# Altium schematic sheet LAUNCHPAD.SchDoc
size 558 x 431 mm; Engineer: Nicholas Oborny; Revision: A.1; Name: Nicholas Oborny; Start Date: 7/23/2012
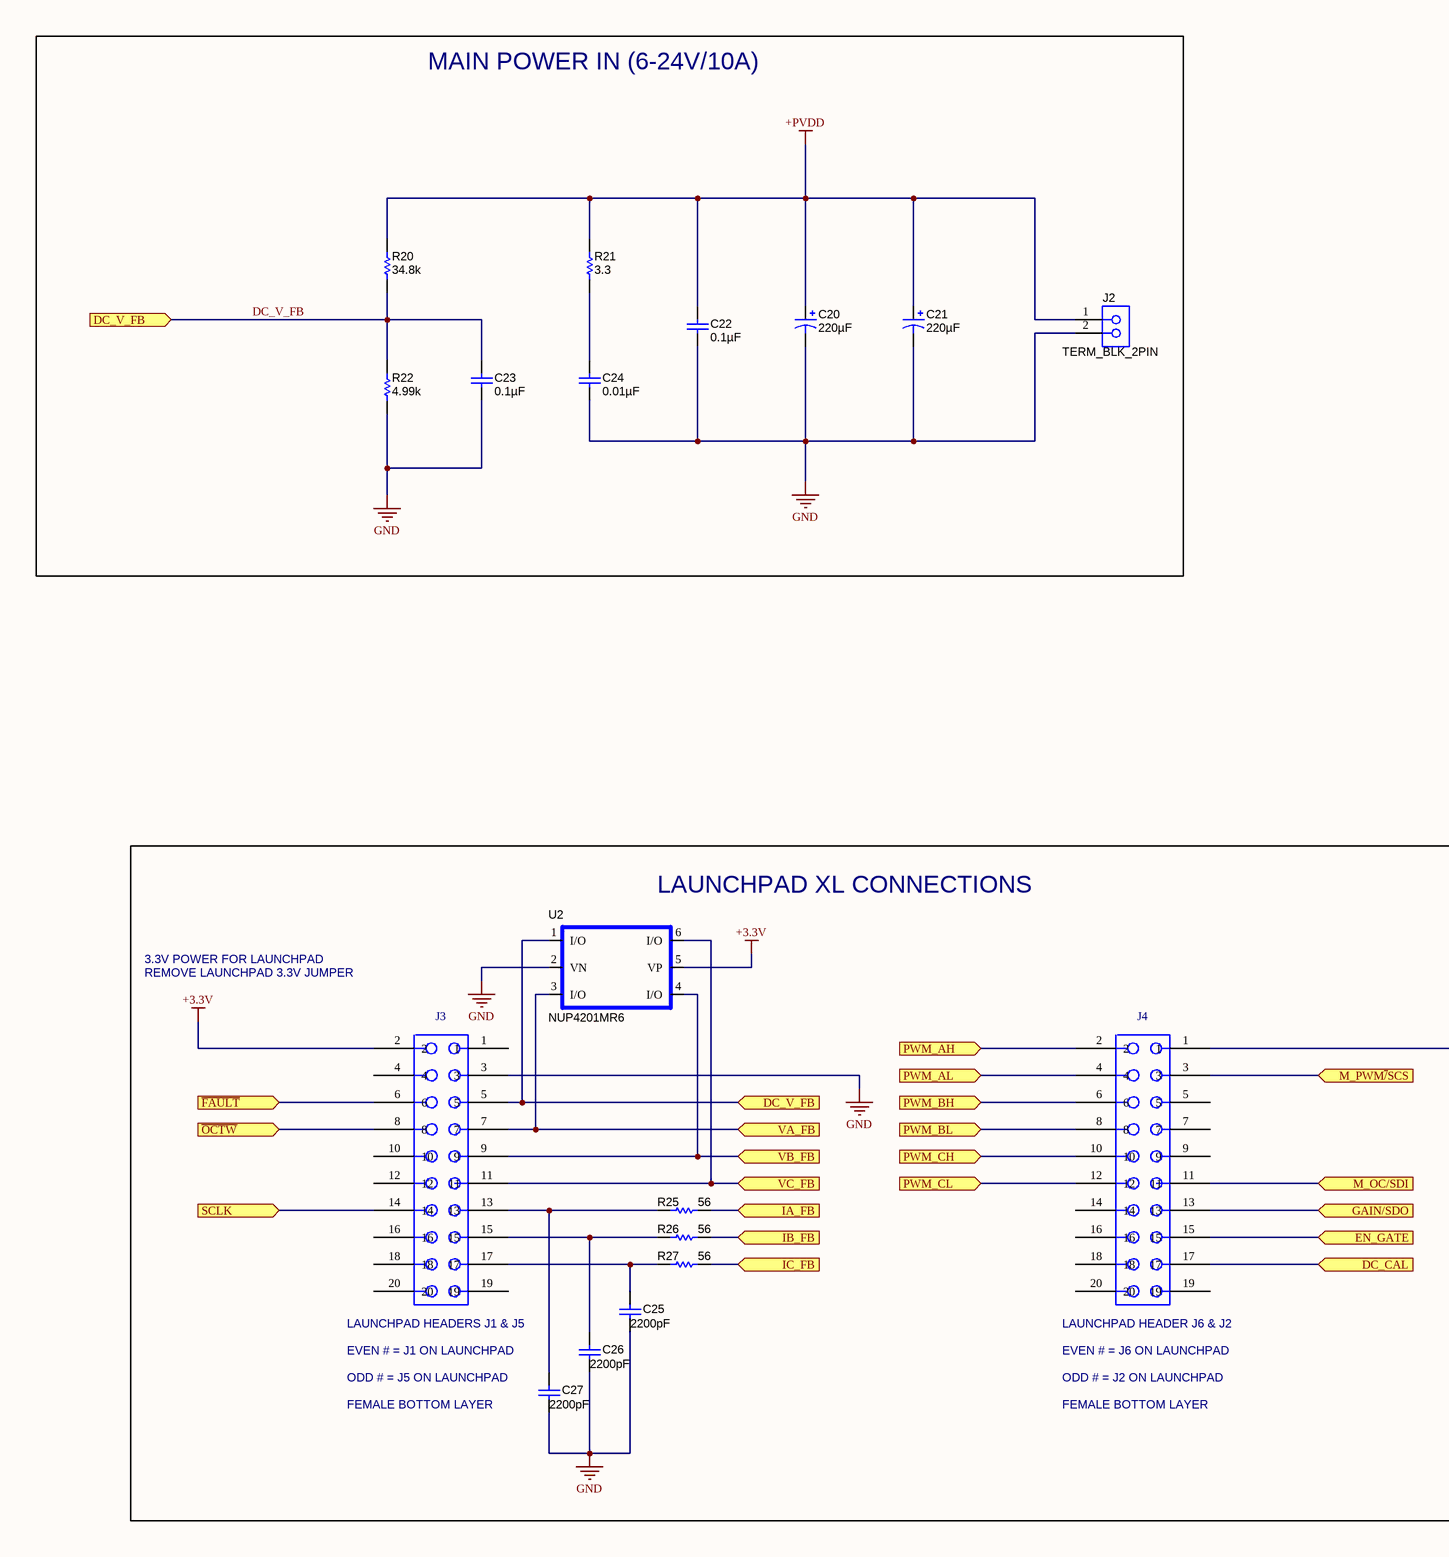
[diagram p0: LAUNCHPAD.SchDoc, left]
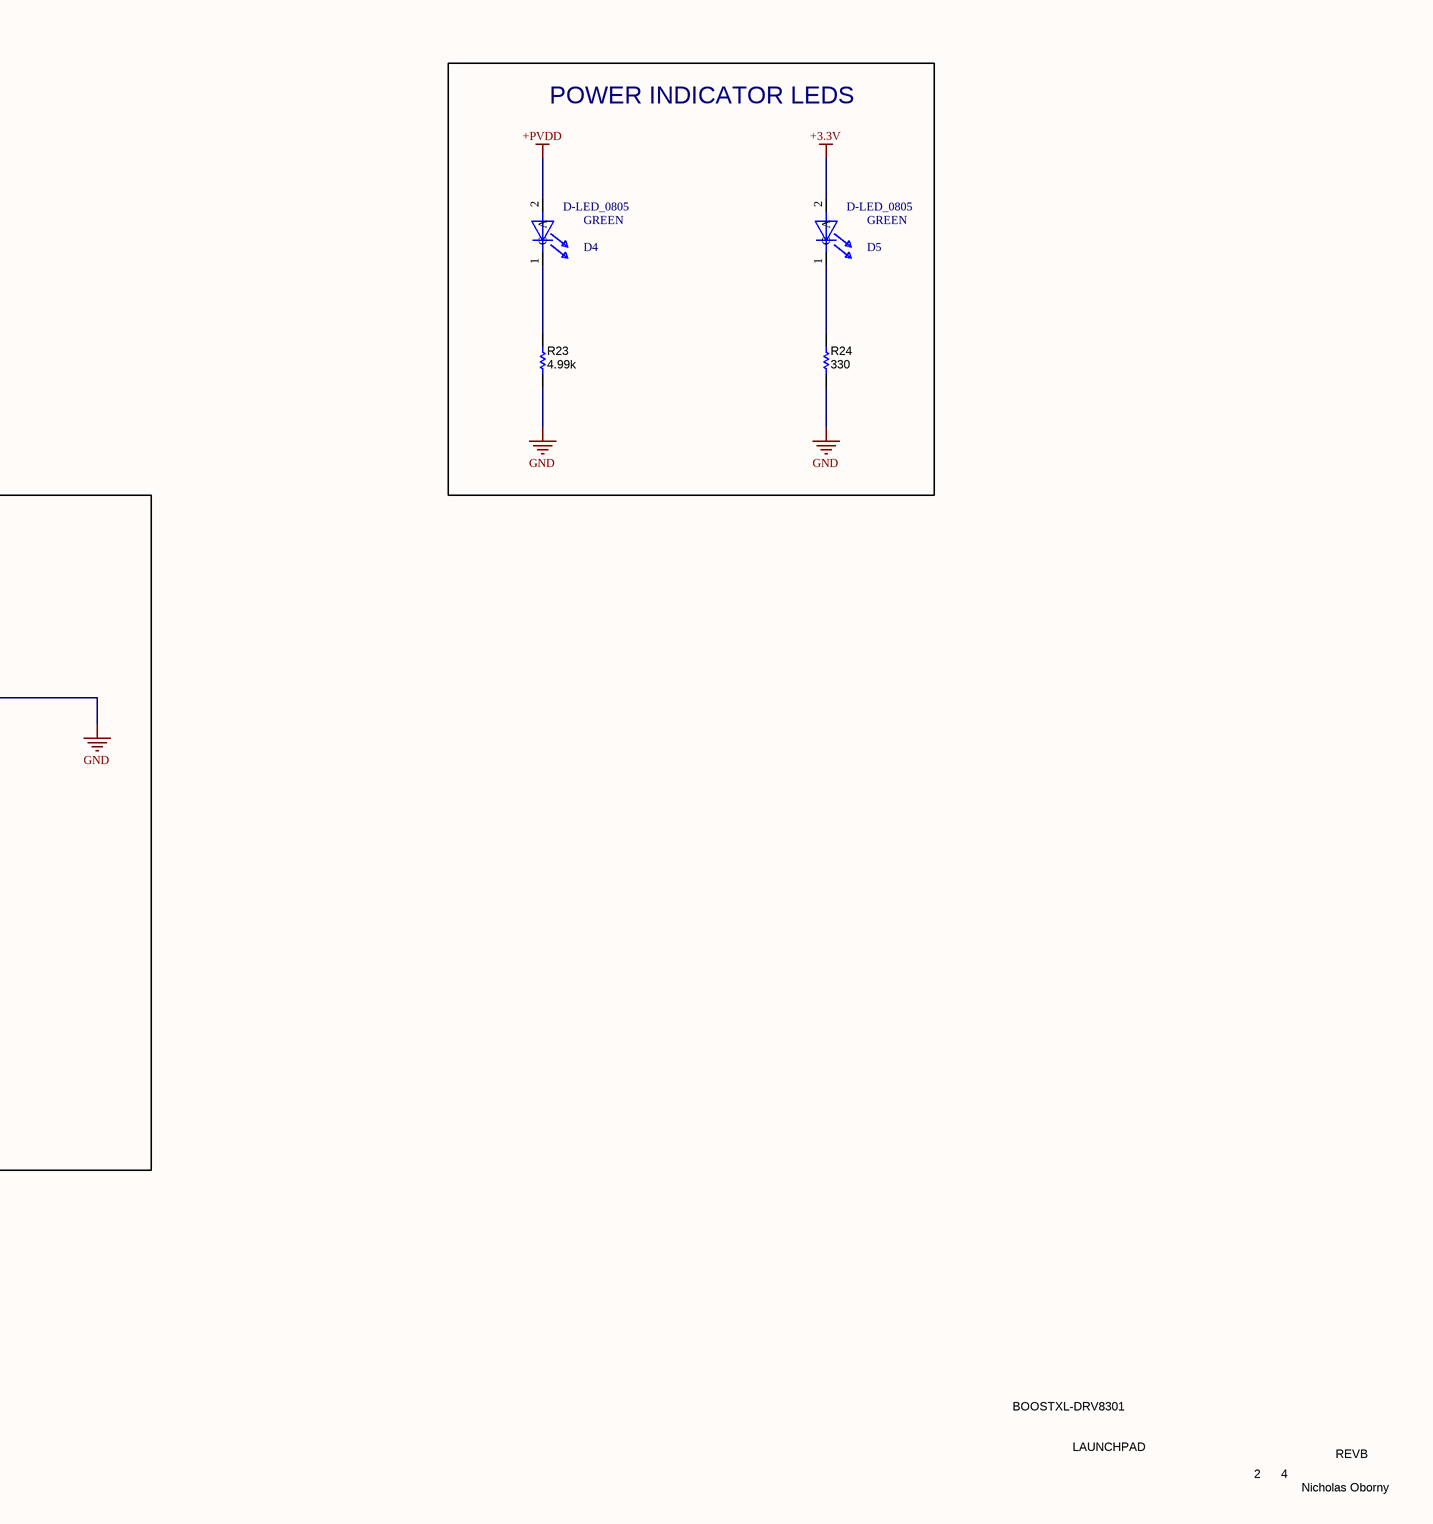
[diagram p1: LAUNCHPAD.SchDoc, right]

## Parts
C20  ValueDisplayed: 220µF  [SM_RADIAL_G]  (hidden comment: EEE-FC1H221P)
C21  ValueDisplayed: 220µF  [SM_RADIAL_G]  (hidden comment: EEE-FC1H221P)
C22  ValueDisplayed: 0.1µF  [0603L]  (hidden comment: GRM188R72A104KA35D)
C23  ValueDisplayed: 0.1µF  [0603L]  (hidden comment: C0603C104J4RACTU)
C24  ValueDisplayed: 0.01µF  [0603L]  (hidden comment: C1608X7R2A103K)
C25  ValueDisplayed: 2200pF  [0603L]  (hidden comment: GRM188R71C222KA01D)
C26  ValueDisplayed: 2200pF  [0603L]  (hidden comment: GRM188R71C222KA01D)
C27  ValueDisplayed: 2200pF  [0603L]  (hidden comment: GRM188R71C222KA01D)
D4  D-LED_0805  value GREEN  [LED_0805]
D5  D-LED_0805  value GREEN  [LED_0805]
J2  TERM_BLK_2PIN  [CONN_ED120-2DS]
J3  HEADER_NPTC202KFM  (value not drawn)
J4  HEADER_NPTC202KFM  (value not drawn)
R20  value 34.8k  [0603L]  (hidden comment: CRCW060334K8FKEA)
R21  value 3.3  [1206L]  (hidden comment: CRCW12063R30JNEA)
R22  value 4.99k  [0603L]  (hidden comment: CRCW06034K99FKEA)
R23  value 4.99k  [0603L]  (hidden comment: CRCW06034K99FKEA)
R24  value 330  [0603L]  (hidden comment: CRCW0603330RJNEA)
R25  value 56  [0603L]  (hidden comment: CRCW060356R0JNEA)
R26  value 56  [0603L]  (hidden comment: CRCW060356R0JNEA)
R27  value 56  [0603L]  (hidden comment: CRCW060356R0JNEA)
U2  NUP4201MR6  [SOT23-6]

## Blocks framed on the sheet
MAIN POWER IN (6-24V/10A): C20-C24 J2 R20-R22
POWER INDICATOR LEDS: D4 D5 R23 R24
LAUNCHPAD XL CONNECTIONS: C25-C27 J3 J4 R25-R27 U2

## Ports
DC_CAL, DC_V_FB, EN_GATE, GAIN/SDO, IA_FB, IB_FB, IC_FB, M_OC/SDI, M_PWM~{/}SCS, PWM_AH, PWM_AL, PWM_BH, PWM_BL, PWM_CH, PWM_CL, SCLK, VA_FB, VB_FB, VC_FB, ~{FAULT}, ~{OCTW}

## Nets
+3.3V: D5.2(A) J3.2 U2.5(VP)
+PVDD: C20.1(+) C21.1(+) C22.1 D4.2(A) J2.1 R20.2 R21.2
GND: C20.2(-) C21.2(-) C22.2 C23.2 C24.2 C25.2 C26.2 C27.2 J2.2 J3.3 J4.1 R22.1 R23.1 R24.1 U2.2(VN)
~{FAULT}: J3.6 ; port ~{FAULT}
~{OCTW}: J3.8 ; port ~{OCTW}
DC_CAL: J4.17 ; port DC_CAL
DC_V_FB: C23.1 J3.5 R20.1 R22.2 U2.1(I/O) ; port DC_V_FB
EN_GATE: J4.15 ; port EN_GATE
GAIN/SDO: J4.13 ; port GAIN/SDO
IA_FB: R25.2 ; port IA_FB
IB_FB: R26.2 ; port IB_FB
IC_FB: R27.2 ; port IC_FB
M_OC/SDI: J4.11 ; port M_OC/SDI
M_PWM~{/}SCS: J4.3 ; port M_PWM~{/}SCS
PWM_AH: J4.2 ; port PWM_AH
PWM_AL: J4.4 ; port PWM_AL
PWM_BH: J4.6 ; port PWM_BH
PWM_BL: J4.8 ; port PWM_BL
PWM_CH: J4.10 ; port PWM_CH
PWM_CL: J4.12 ; port PWM_CL
SCLK: J3.14 ; port SCLK
VA_FB: J3.7 U2.3(I/O) ; port VA_FB
VB_FB: J3.9 U2.4(I/O) ; port VB_FB
VC_FB: J3.11 U2.6(I/O) ; port VC_FB
NetC24_1: C24.1 R21.1
NetC25_1: C25.1 J3.17 R27.1
NetC26_1: C26.1 J3.15 R26.1
NetC27_1: C27.1 J3.13 R25.1
NetD4_1: D4.1(C) R23.2
NetD5_1: D5.1(C) R24.2

Not connected (* = marked no-connect by the designer): J3 1 4 10 12 16 18 19 20; J4 5 7 9 14 16 18 19 20

## Notes on the sheet
- 3.3V POWER FOR LAUNCHPAD
- REMOVE LAUNCHPAD 3.3V JUMPER
- (near J3) LAUNCHPAD HEADERS J1 & J5
- EVEN # = J1 ON LAUNCHPAD
- (near J4) LAUNCHPAD HEADER J6 & J2
- EVEN # = J6 ON LAUNCHPAD
- ODD # = J5 ON LAUNCHPAD
- FEMALE BOTTOM LAYER
- ODD # = J2 ON LAUNCHPAD
- BOOSTXL-DRV8301
- LAUNCHPAD
- 2
- 4
- REVB
- Nicholas Oborny

## Library data of the parts
C20 C21 = EEE-FC1H221P: CAP, AL, 220uF, 50V, +/-20%, 0.3 ohm, SMD; Manufacturer: Panasonic; Polarized: Y; CompType: Capacitor; U/M: EA; Cap_F: 0.00022; Tolerance_%: 20; Value1: 0.3 ohm; VDC_V: 50; ESR_Ohm: 0.3; IRMS_A: 0.5; TaMin_C: -40; TaMax_C: 105; Cap_Case: G; SymbolVersion: 2008-07-09; Value: 220uF; PartNumber: EEE-FC1H221P; PackageReference: SMT Radial G; RoHS: Y; Value2: 50V; MountType: SMT; Technology: AL; Series: FC; Publisher: Texas Instruments; LatestRevisionDate: 2013-05-31; ComponentLink1Description: Datasheet link; ComponentLink1URL: http://www.panasonic.com/industrial/components/pdf/smt_aec_050505.pdf; Supplier 1: Digi-Key; Supplier Part Number 1: PCE4016CT-ND; Supplier 2: Mouser; Supplier Part Number 2: 667-EEE-FC1H221P; Supplier 3: Farnell; Supplier Part Number 3: 9694579
C22 = GRM188R72A104KA35D: CAP, CERM, 0.1uF, 100V, +/-10%, X7R, 0603; Manufacturer: MuRata; Polarized: N; CompType: Capacitor; U/M: EA; Cap_F: 0.0000001; Tolerance_%: 10; Value1: Unknown; VDC_V: 100; TaMin_C: -55; TaMax_C: 125; Cap_Case: 0603; SymbolVersion: 2008-07-09; Value: 0.1uF; PartNumber: GRM188R72A104KA35D; PackageReference: 0603; RoHS: Y; Value2: 100V; MountType: SMT; Technology: Ceramic; TempCo: X7R; Published: 2008-06-19; Publisher: Texas Instruments; LatestRevisionDate: 2013-05-24; LatestRevisionNote: Changed publisher; ComponentLink1Description: Datasheet link; ComponentLink1URL: http://search.murata.co.jp/Ceramy/PnsearchViewAction.do?HnOFG=ON&HnNFG=ON&SEL_CNT=50&sLang=en&sKey=GRM188R72A104KA35D&x=9&y=9&search=startwith; Supplier 1: Digi-Key; Supplier Part Number 1: 490-3285-1-ND; Supplier 2: Mouser; Supplier Part Number 2: 81-GRM188R72A104KA35; Supplier 3: Farnell; Supplier Part Number 3: 1828921
C23 = C0603C104J4RACTU: CAP, CERM, 0.1uF, 16V, +/-5%, X7R, 0603; Manufacturer: Kemet; Polarized: N; CompType: Capacitor; U/M: EA; Cap_F: 0.0000001; Tolerance_%: 5; Value1: Unknown; VDC_V: 16; TaMin_C: -55; TaMax_C: 125; Cap_Case: 0603; SymbolVersion: 2008-07-09; Value: 0.1uF; PartNumber: C0603C104J4RACTU; PackageReference: 0603; RoHS: Y; Value2: 16V; MountType: SMT; Technology: Ceramic; TempCo: X7R; Published: 2008-06-19; Publisher: Texas Instruments; LatestRevisionDate: 2013-05-24; LatestRevisionNote: Changed publisher; ComponentLink1Description: Datasheet link; ComponentLink1URL: http://www.kemet.com/kemet/web/homepage/kechome.nsf/vapubfiles/F3102_Y5V.pdf/$file/F3102_Y5V.pdf; Supplier 1: Digi-Key; Supplier Part Number 1: 399-1097-1-ND; Supplier 2: Mouser; Supplier Part Number 2: 80-C0603C104J4R; Supplier 3: Farnell; Supplier Part Number 3: 1650834
C24 = C1608X7R2A103K: CAP, CERM, 0.01uF, 100V, +/-10%, X7R, 0603; Manufacturer: TDK; Polarized: N; CompType: Capacitor; U/M: EA; Cap_F: 0.00000001; Tolerance_%: 10; ESR_Ohm: 0.0661; Value1: 0.0661 ohm; VDC_V: 100; TaMin_C: -55; TaMax_C: 125; Cap_Case: 0603; SymbolVersion: 2008-07-09; Value: 0.01uF; PartNumber: C1608X7R2A103K; PackageReference: 0603; RoHS: Y; Value2: 100V; MountType: SMT; Technology: Ceramic; TempCo: X7R; Published: 2008-06-19; Publisher: Texas Instruments; LatestRevisionDate: 2013-05-24; LatestRevisionNote: Changed publisher; ComponentLink1Description: Datasheet link; ComponentLink1URL: http://www.tdk.co.jp/tefe02/e412_c.pdf; Supplier 1: Digi-Key; Supplier Part Number 1: 445-1304-1-ND; Supplier 2: Farnell; Supplier Part Number 2: 1907322
C25-C27 = GRM188R71C222KA01D: CAP, CERM, 2200pF, 16V, +/-10%, X7R, 0603; Manufacturer: MuRata; Polarized: N; CompType: Capacitor; U/M: EA; Cap_F: 0.0000000022; Tolerance_%: 10; Value1: Unknown; VDC_V: 16; TaMin_C: -55; TaMax_C: 125; Cap_Case: 0603; SymbolVersion: 2008-07-09; Value: 2200pF; PartNumber: GRM188R71C222KA01D; PackageReference: 0603; RoHS: Y; Value2: 16V; MountType: SMT; Technology: Ceramic; TempCo: X7R; Published: 2008-06-19; Publisher: Texas Instruments; LatestRevisionDate: 2013-05-24; LatestRevisionNote: Changed publisher; ComponentLink1Description: Datasheet link; ComponentLink1URL: http://search.murata.co.jp/Ceramy/PnsearchViewAction.do?HnOFG=ON&HnNFG=ON&SEL_CNT=50&sLang=en&sKey=GRM188R71C222KA01D&x=9&y=9&search=startwith; Supplier 1: Digi-Key; Supplier Part Number 1: GRM188R71C222KA01D-ND; Supplier 2: Mouser; Supplier Part Number 2: 81-GRM188R71C222KA1D
D4 = D-LED_0805: LED THIN 565NM GRN DIFF 0805 SMD; PartNumber: SML-LXT0805GW-TR; Manufacturer: Lumex Opto/Components Inc; Vendor Part #: 67-1553-1-ND; Area: 2.5 mm; Vendor: DigiKey; ModifyDate: 10/26/2011 10:26:35; PCB DECAL: LED-0805; ComponentHeight: 0.8 mm; Size: 805
D5 = D-LED_0805: LED THIN 565NM GRN DIFF 0805 SMD; PartNumber: SML-LXT0805GW-TR; Manufacturer: Lumex Opto/Components Inc; Vendor Part #: 67-1553-1-ND; PCB DECAL: LED-0805C; Area: 2.5 mm; Vendor: DigiKey; ModifyDate: 10/26/2011 10:26:35; ComponentHeight: 0.8mm; Size: 805
J2 = ED120/2DS: TERMINAL BLOCK 5.08MM VERT 2POS; PartNumber: OSTTA024163; Manufacturer: On-Shore Technology; U/M: EA; Value: 2 Pin Header; SymbolVersion: 2010-10-20; CompType: Terminal Block; RoHS: Y; PackageReference: TERM_BLK, 2pos, 5.08mm; MountType: TH; Publisher: Texas Instruments; LatestRevisionDate: 2013-06-04; Supplier 1: Digi-Key; Supplier Part Number 1: ED2580-ND
J3 J4 = HEADER_NPTC202KFM: CONN RCPT 20POS .100 DL STR SMD; PartNumber: 89898-310ALF; Manufacturer: FCI; Vendor Part #: 609-4473-1-ND; Second Source: C:\program files\p-cad 2004\HEADER_NPTC-SERIES.pdf; Reference: \\vette02\pmp_pcb\pcad_pdf's\HEADER_NPTC-SERIES.pdf; Area: 363000; Value: 20-Pin/2-Row; Vendor: DigiKey; ModifyDate: 07/24/2012 09:28:03; Size: 0.270X1.020; ComponentHeight: 0.30mil; PCB DECAL: HEADER_NPTC202KFM
R20 = CRCW060334K8FKEA: RES, 34.8k ohm, 1%, 0.1W, 0603; Manufacturer: Vishay-Dale; CompType: Resistor; Res_ohm: 34800; Value_Code: 34k8; Tolerance_%: 1; Power_W: 0.1; VDC_V: 75; TempCo: 100 ppm/C; EIA_Code: E96; U/M: EA; SymbolVersion: 2009-05-29; PartNumber: CRCW060334K8FKEA; PackageReference: 0603; RoHS: Y; Value1: 1%; Value2: 0.1W; MountType: SMT; Technology: Thick Film; Published: 2008-06-26; Publisher: Texas Instruments; LatestRevisionDate: 2013-01-08; ComponentLink1Description: Datasheet link; ComponentLink1URL: http://www.vishay.com/docs/20035/dcrcwe3.pdf; Supplier 1: Digi-Key; Supplier Part Number 1: 541-34.8KHCT-ND; Supplier 2: Mouser; Supplier Part Number 2: 71-CRCW0603-34.8K-E3; Supplier 3: Farnell; Supplier Part Number 3: 1151951
R21 = CRCW12063R30JNEA: RES, 3.3 ohm, 5%, 0.25W, 1206; Manufacturer: Vishay-Dale; CompType: Resistor; Value_Code: 3R30; Tolerance_%: 5; Power_W: 0.25; VDC_V: 200; TempCo: 200 ppm/C; EIA_Code: E24; U/M: EA; SymbolVersion: 2009-05-29; PartNumber: CRCW12063R30JNEA; PackageReference: 1206; RoHS: Y; Res_ohm: 3.3; Value1: 5%; Value2: 0.25W; MountType: SMT; Technology: Thick Film; Published: 2008-06-26; Publisher: Texas Instruments; LatestRevisionDate: 2013-01-18; ComponentLink1Description: Datasheet link; ComponentLink1URL: http://www.vishay.com/docs/20035/dcrcwe3.pdf; Supplier 1: Digi-Key; Supplier Part Number 1: 541-3.3ECT-ND; Supplier 2: Mouser; Supplier Part Number 2: 71-CRCW1206J-3.3-E3; Supplier 3: Farnell; Supplier Part Number 3: 1540015
R22 R23 = CRCW06034K99FKEA: RES, 4.99k ohm, 1%, 0.1W, 0603; Manufacturer: Vishay-Dale; CompType: Resistor; Res_ohm: 4990; Value_Code: 4k99; Tolerance_%: 1; Power_W: 0.1; VDC_V: 75; TempCo: 100 ppm/C; EIA_Code: E96; U/M: EA; SymbolVersion: 2009-05-29; PartNumber: CRCW06034K99FKEA; PackageReference: 0603; RoHS: Y; Value1: 1%; Value2: 0.1W; MountType: SMT; Technology: Thick Film; Published: 2008-06-26; Publisher: Texas Instruments; LatestRevisionDate: 2013-01-08; ComponentLink1Description: Datasheet link; ComponentLink1URL: http://www.vishay.com/docs/20035/dcrcwe3.pdf; Supplier 1: Digi-Key; Supplier Part Number 1: 541-4.99KHCT-ND; Supplier 2: Mouser; Supplier Part Number 2: 71-CRCW0603-4.99K-E3; Supplier 3: Farnell; Supplier Part Number 3: 1652885
R24 = CRCW0603330RJNEA: RES, 330 ohm, 5%, 0.1W, 0603; Manufacturer: Vishay-Dale; CompType: Resistor; Value_Code: 330R; Tolerance_%: 5; Power_W: 0.1; VDC_V: 75; TempCo: 200 ppm/C; EIA_Code: E24; U/M: EA; SymbolVersion: 2009-05-29; PartNumber: CRCW0603330RJNEA; PackageReference: 0603; RoHS: Y; Res_ohm: 330; Value1: 5%; Value2: 0.1W; MountType: SMT; Technology: Thick Film; Published: 2008-06-26; Publisher: Texas Instruments; LatestRevisionDate: 2013-01-08; ComponentLink1Description: Datasheet link; ComponentLink1URL: http://www.vishay.com/docs/20035/dcrcwe3.pdf; Supplier 1: Digi-Key; Supplier Part Number 1: 541-330GCT-ND; Supplier 2: Mouser; Supplier Part Number 2: 71-CRCW0603J-330-E3; Supplier 3: Farnell; Supplier Part Number 3: 1692522
R25-R27 = CRCW060356R0JNEA: RES, 56 ohm, 5%, 0.1W, 0603; Manufacturer: Vishay-Dale; CompType: Resistor; Value_Code: 56R0; Tolerance_%: 5; Power_W: 0.1; VDC_V: 75; TempCo: 200 ppm/C; EIA_Code: E24; U/M: EA; SymbolVersion: 2009-05-29; PartNumber: CRCW060356R0JNEA; PackageReference: 0603; RoHS: Y; Res_ohm: 56; Value1: 5%; Value2: 0.1W; MountType: SMT; Technology: Thick Film; Published: 2008-06-26; Publisher: Texas Instruments; LatestRevisionDate: 2013-01-08; ComponentLink1Description: Datasheet link; ComponentLink1URL: http://www.vishay.com/docs/20035/dcrcwe3.pdf; Supplier 1: Digi-Key; Supplier Part Number 1: 541-56GCT-ND; Supplier 2: Mouser; Supplier Part Number 2: 71-CRCW0603J-56-E3; Supplier 3: Farnell; Supplier Part Number 3: 1514781
U2 = NUP4201MR6: IC,  500w 6v, Transient Voltage  Suppressors; Manufacturer: On Semi; Area: 20.1 mm; ComponentHeight: 1 mm; SymbolVersion: 04/10/2012 10:34:18; PartNumber: NUP4201MR6; ComponentLink1URL: \\vette02\pmp_pcb\pcad_pdf's\NUP4201MR6-D.pdf; PackageReference: SOT; Value: NUP4201MR6; ComponentLink1Description: AEO Datasheet Link